# EasyEDA schematic SCH_未来工程师大赛-於铄-消毒盒_2023-09-22.json
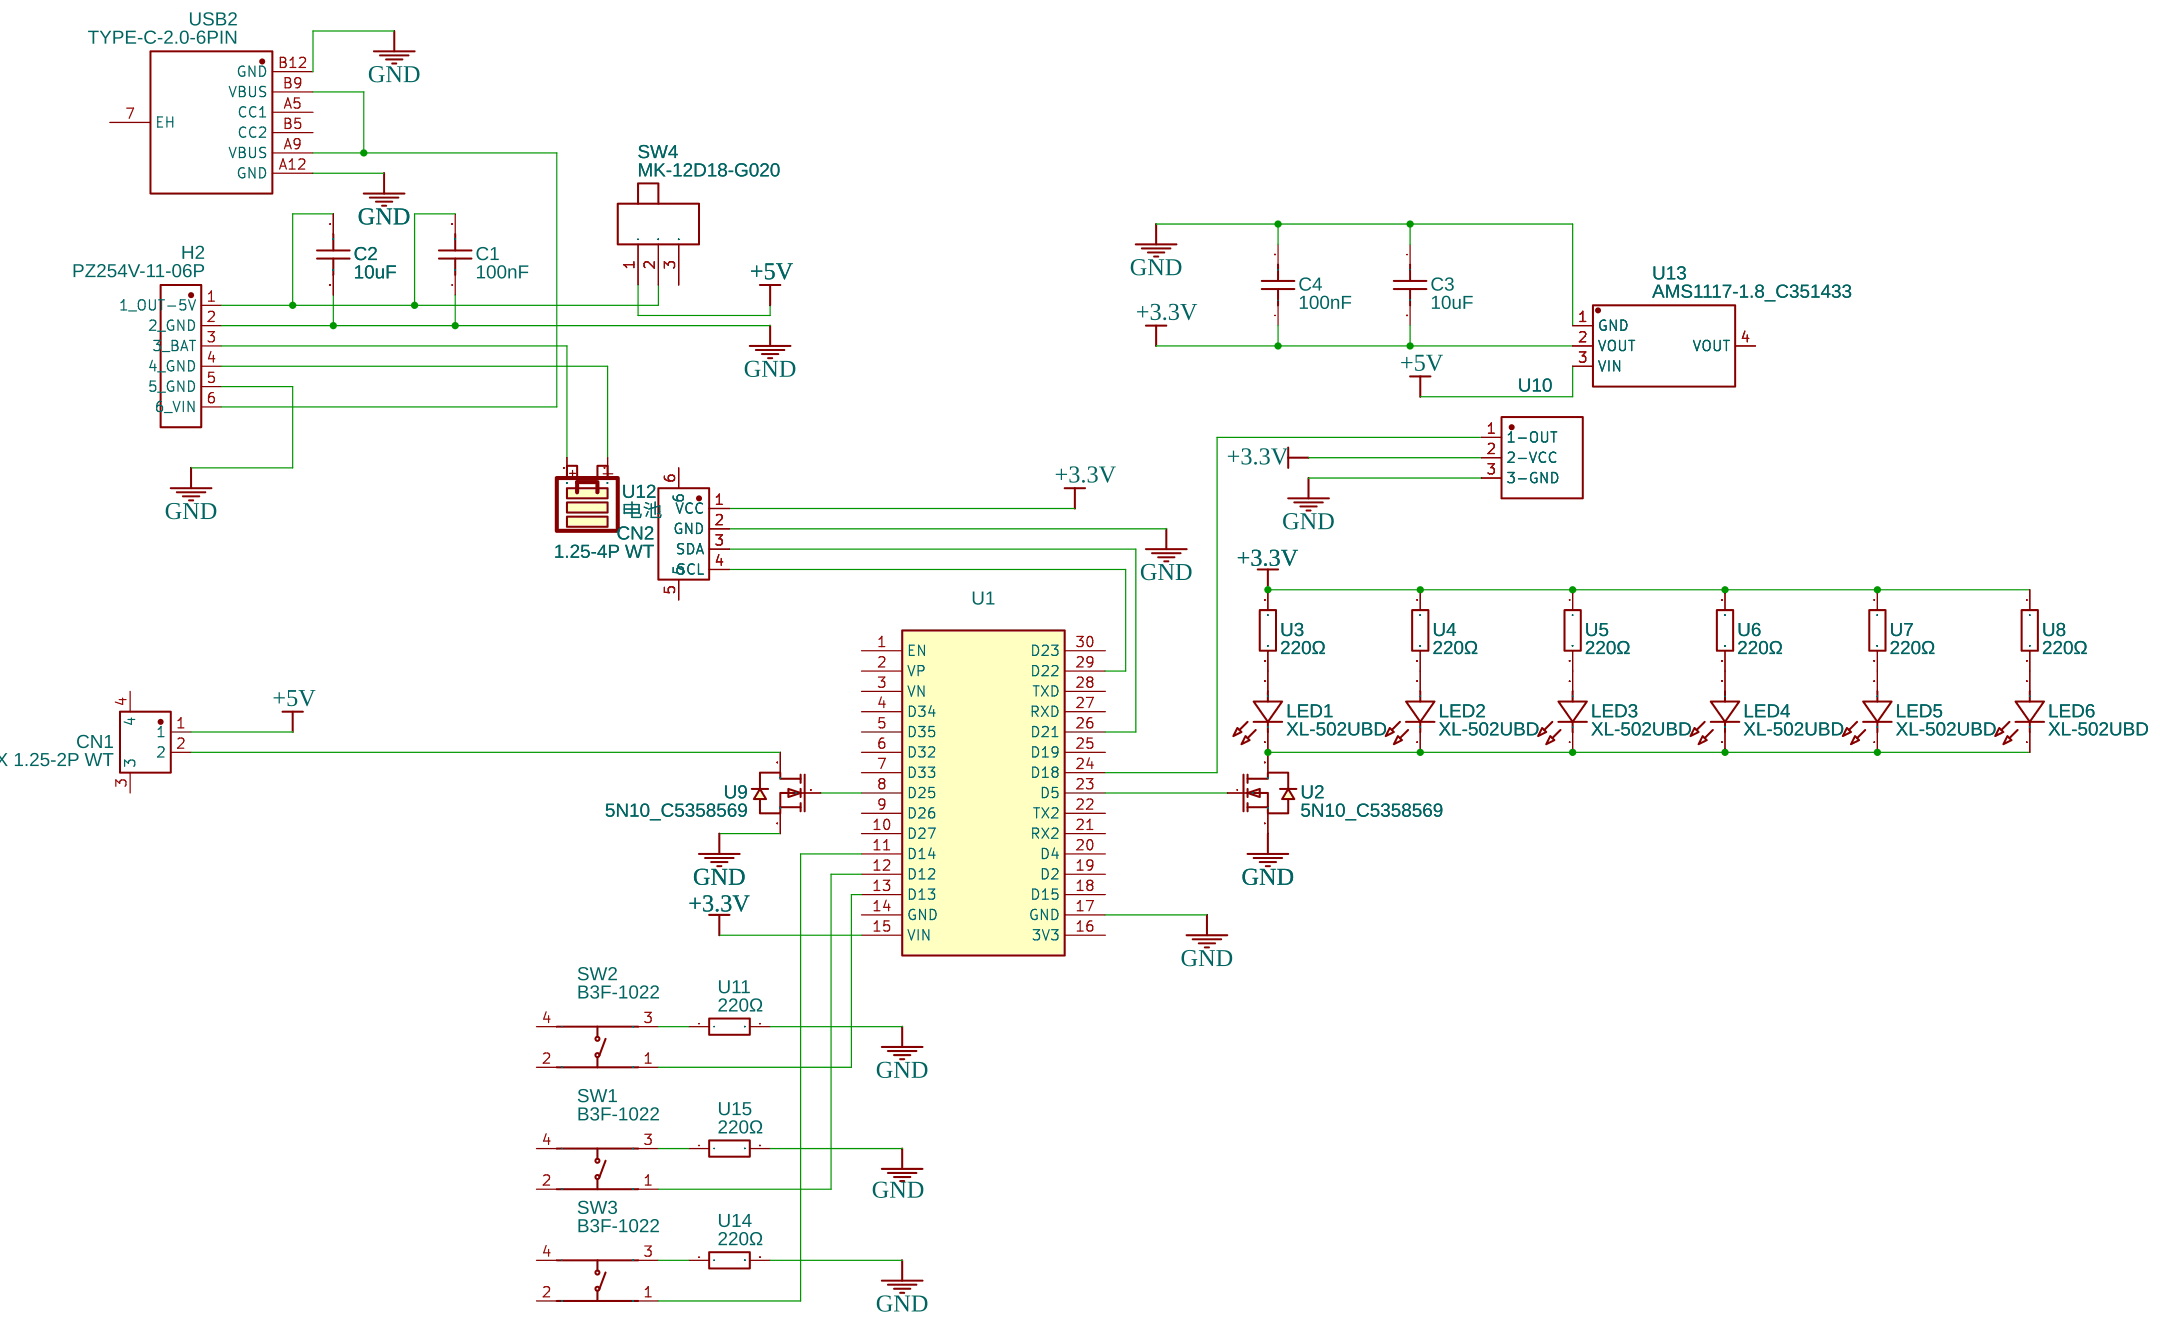
[diagram p0: schematic sheet]

## Parts
C1  100nF  [C0603]
C2  10uF  [C0603]
C3  10uF  [C0603]
C4  100nF  [C0603]
CN1  HX 1.25-2P WT  [CONN-SMD_2P-P1.25_HX1.25-2PWT]
CN2  1.25-4P WT  [CONN-SMD_1.25-4PWT]
H2  PZ254V-11-06P  [HDR-TH_6P-P2.54-V-M]
LED1  XL-502UBD  [LED-TH_BD5.9-P2.54-RD_BLUE]
LED2  XL-502UBD  [LED-TH_BD5.9-P2.54-RD_BLUE]
LED3  XL-502UBD  [LED-TH_BD5.9-P2.54-RD_BLUE]
LED4  XL-502UBD  [LED-TH_BD5.9-P2.54-RD_BLUE]
LED5  XL-502UBD  [LED-TH_BD5.9-P2.54-RD_BLUE]
LED6  XL-502UBD  [LED-TH_BD5.9-P2.54-RD_BLUE]
SW1  B3F-1022  [SW-TH_4P-L6.0-W6.0-P4.50-LS6.5]
SW2  B3F-1022  [SW-TH_4P-L6.0-W6.0-P4.50-LS6.5]
SW3  B3F-1022  [SW-TH_4P-L6.0-W6.0-P4.50-LS6.5]
SW4  MK-12D18-G020  [SW-TH_MK-12D18-G040]
U1  NO  [ESP-WROOM-32]
U2  5N10_C5358569  [SOT-23-3_L2.9-W1.3-P1.90-LS2.4-BR]
U3  220Ω  [RES-TH_BD2.3-L3.7-P7.70-D0.9]
U4  220Ω  [RES-TH_BD2.3-L3.7-P7.70-D0.9]
U5  220Ω  [RES-TH_BD2.3-L3.7-P7.70-D0.9]
U6  220Ω  [RES-TH_BD2.3-L3.7-P7.70-D0.9]
U7  220Ω  [RES-TH_BD2.3-L3.7-P7.70-D0.9]
U8  220Ω  [RES-TH_BD2.3-L3.7-P7.70-D0.9]
U9  5N10_C5358569  [SOT-23-3_L2.9-W1.3-P1.90-LS2.4-BR]
U10  NO  [SR602]
U11  220Ω  [RES-TH_BD2.3-L3.7-P7.70-D0.9]
U12  电池  [双孔排针]
U13  AMS1117-1.8_C351433  [SOT-223_L6.5-W3.5-P2.30-LS7.0-BR]
U14  220Ω  [RES-TH_BD2.3-L3.7-P7.70-D0.9]
U15  220Ω  [RES-TH_BD2.3-L3.7-P7.70-D0.9]
USB2  TYPE-C-2.0-6PIN  [TYPE-C-SMD_TYPE-C-6P-2]

## Library data of the parts
C1 C4 = MC0603B104K500N8RH: Contributor: lcsc; Supplier: LCSC; Supplier Part: C3152610; Manufacturer: Sunway(信维通信); JLCPCB Part Class: Extended Part; link: https://so.szlcsc.com/global.html?k=C3152610&ref=editor
C2 C3 = 10UF: Contributor: LCSC; Supplier: LCSC; Supplier Part: C15415; Manufacturer: SAMSUNG(三星); JLCPCB Part Class: Extended Part; link: https://so.szlcsc.com/global.html?k=C15415&ref=editor
CN1 = HX 1.25-2P WT: Contributor: lcsc; Supplier: LCSC; Supplier Part: C5142069; Manufacturer: hanxia(韩下); JLCPCB Part Class: Extended Part; link: https://so.szlcsc.com/global.html?k=C5142069&ref=editor
CN2 = 1.25-4P WT: Contributor: LCSC; Supplier: LCSC; Supplier Part: C668615; Manufacturer: SHOU HAN(首韩); JLCPCB Part Class: Extended Part; link: https://so.szlcsc.com/global.html?k=C668615&ref=editor
H2 = PZ254V-11-06P: Contributor: LCSC; Supplier: LCSC; Supplier Part: C492405; Manufacturer: XFCN(兴飞); JLCPCB Part Class: Extended Part; link: https://so.szlcsc.com/global.html?k=C492405&ref=editor
LED1-LED6 = XL-502UBD: Contributor: lcsc; Supplier: LCSC; Supplier Part: C2895496; Manufacturer: XINGLIGHT(成兴光); JLCPCB Part Class: Extended Part; link: https://so.szlcsc.com/global.html?k=C2895496&ref=editor
SW1-SW3 = B3F-1022: Contributor: LCSC; Supplier: LCSC; Supplier Part: C231317; Manufacturer: OMRON(欧姆龙); JLCPCB Part Class: Extended Part; link: https://so.szlcsc.com/global.html?k=C231317&ref=editor
SW4 = MK-12D18-G020: Contributor: lcsc; Supplier: LCSC; Supplier Part: C3019727; Manufacturer: G-Switch(品赞); JLCPCB Part Class: Extended Part; link: https://so.szlcsc.com/global.html?k=C3019727&ref=editor
U1 = ESP-WROOM-32: Contributor: ch-hs
U2 U9 = 5N10_C5358569: Contributor: lcsc; Supplier: LCSC; Supplier Part: C5358569; Manufacturer: GOODWORK(固得沃克); Manufacturer Part: 5N10; link: https://so.szlcsc.com/global.html?k=C5358569&ref=editor
U3-U8 U11 U14 U15 = MF1/8W-220Ω±1%-ST52: Contributor: lcsc; Supplier: LCSC; Supplier Part: C2848572; Manufacturer: VO(翔胜); JLCPCB Part Class: Extended Part; link: https://so.szlcsc.com/global.html?k=C2848572&ref=editor
U10 = SR602: Contributor: czeda
U12 = 电池: Contributor: eittle
U13 = AMS1117-1.8_C351433: Contributor: LCSC; Supplier: LCSC; Supplier Part: C351433; Manufacturer: PUOLOP(迪浦); Manufacturer Part: AMS1117-1.8; JLCPCB Part Class: Extended Part; link: https://so.szlcsc.com/global.html?k=C351433&ref=editor
USB2 = TYPE-C-2.0-6PIN: Contributor: lcsc; Supplier: LCSC; Supplier Part: C2987385; Manufacturer: CIKI(皓富); Manufacturer Part: Type-C-2.0-6Pin; JLCPCB Part Class: Extended Part; link: https://so.szlcsc.com/global.html?k=C2987385&ref=editor

## Nets
+3.3V: C3.2 C4.1 CN2.1(VCC) U1.15(VIN) U3.1 U4.1 U5.1 U6.1 U7.1 U8.1 U10.2(2-VCC) U13.2(VOUT)
+5V: CN1.1 SW4.1 U13.3(VIN)
GND: C1.1 C2.2 C3.1 C4.2 CN2.2(GND) H2.2(2 GND) H2.5(5 GND) U1.17(GND) U2.2(S) U9.2(S) U10.3(3-GND) U11.2 U13.1(GND) U14.2 U15.2 USB2.A12(GND) USB2.B12(GND)
Net-(C1-2): C1.2 C2.1 H2.1(1 OUT-5V) SW4.2
Net-(CN1-2): CN1.2 U9.3(D)
Net-(CN2-3): CN2.3(SDA) U1.26(D21)
Net-(CN2-4): CN2.4(SCL) U1.29(D22)
Net-(H2-3): H2.3(3 BAT) U12.1
Net-(H2-4): H2.4(4 GND) U12.2
Net-(H2-6): H2.6(6 VIN) USB2.A9(VBUS) USB2.B9(VBUS)
Net-(LED1-1): LED1.1(K) LED2.1(K) LED3.1(K) LED4.1(K) LED5.1(K) LED6.1(K) U2.3(D)
Net-(LED1-2): LED1.2(A) U3.2
Net-(LED2-2): LED2.2(A) U4.2
Net-(LED3-2): LED3.2(A) U5.2
Net-(LED4-2): LED4.2(A) U6.2
Net-(LED5-2): LED5.2(A) U7.2
Net-(LED6-2): LED6.2(A) U8.2
Net-(SW1-1): SW1.1 U1.12(D12)
Net-(SW1-3): SW1.3 U15.1
Net-(SW2-1): SW2.1 U1.13(D13)
Net-(SW2-3): SW2.3 U11.1
Net-(SW3-1): SW3.1 U1.11(D14)
Net-(SW3-3): SW3.3 U14.1
Net-(U1-8): U1.8(D25) U9.1(G)
Net-(U1-23): U1.23(D5) U2.1(G)
Net-(U1-24): U1.24(D18) U10.1(1-OUT)

Not connected (* = marked no-connect by the designer): CN1 3 4; CN2 5 6; SW1 2 4; SW2 2 4; SW3 2 4; SW4 3; U1 1(EN) 2(VP) 3(VN) 4(D34) 5(D35) 6(D32) 7(D33) 9(D26) 10(D27) 14(GND) 16(3V3) 18(D15) 19(D2) 20(D4) 21(RX2) 22(TX2) 25(D19) 27(RXD) 28(TXD) 30(D23); U13 4(VOUT); USB2 7(EH) A5(CC1) B5(CC2)
